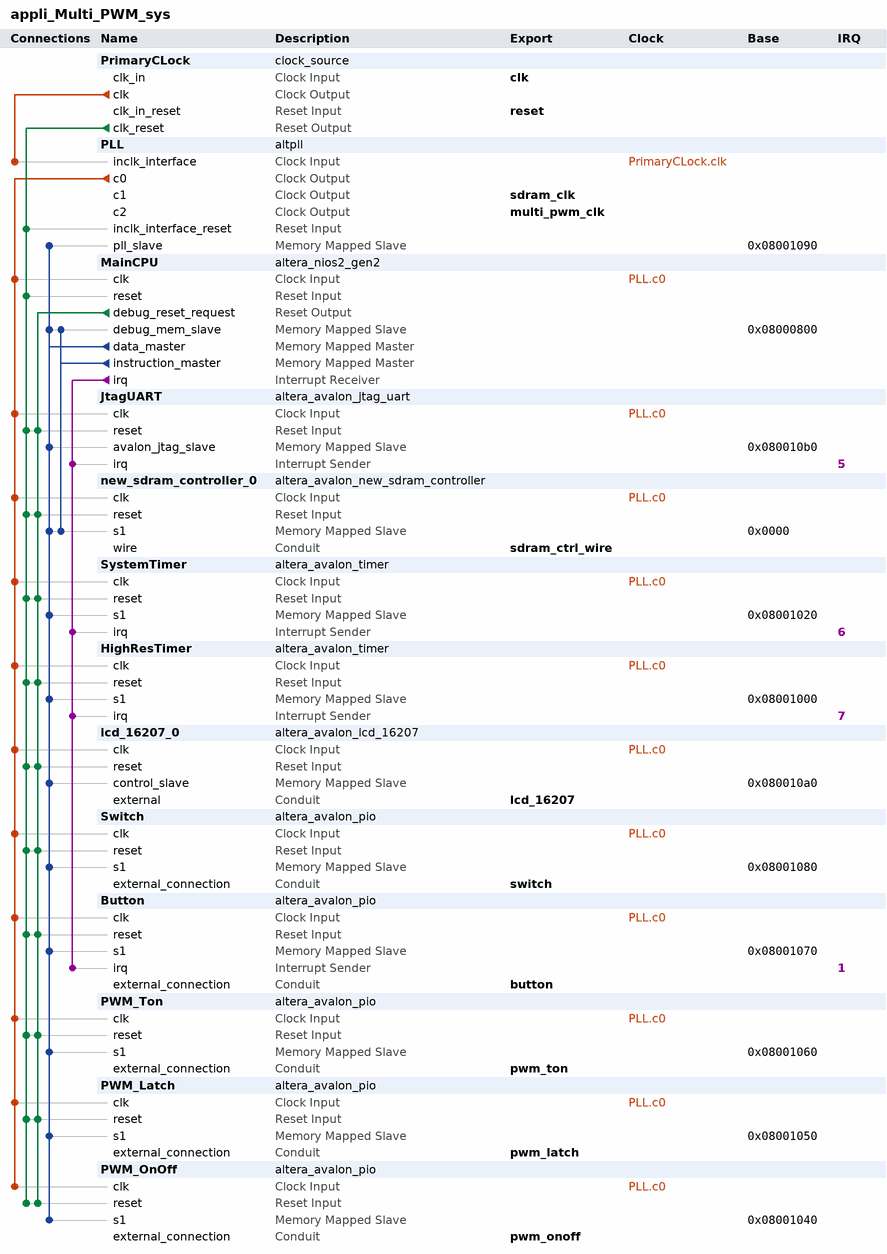
[diagram p0: system contents]
# Platform Designer (Qsys) system appli_Multi_PWM_sys, Cyclone IV E EP4CE115F29C7
# Parameters at their usual value, and those the tool derives, are not listed.
package require -exact qsys 17.1
create_system appli_Multi_PWM_sys
set_project_property DEVICE_FAMILY {Cyclone IV E}
set_project_property DEVICE EP4CE115F29C7

add_instance PrimaryCLock clock_source 17.1
set_instance_parameter_value PrimaryCLock clockFrequency 50000000

add_instance PLL altpll 17.1
set_instance_parameter_value PLL CLK0_DIVIDE_BY 1
set_instance_parameter_value PLL CLK0_MULTIPLY_BY 2
set_instance_parameter_value PLL CLK1_DIVIDE_BY 1
set_instance_parameter_value PLL CLK1_DUTY_CYCLE 50
set_instance_parameter_value PLL CLK1_MULTIPLY_BY 2
set_instance_parameter_value PLL CLK1_PHASE_SHIFT -1667
set_instance_parameter_value PLL CLK2_DIVIDE_BY 3125
set_instance_parameter_value PLL CLK2_DUTY_CYCLE 50
set_instance_parameter_value PLL CLK2_MULTIPLY_BY 64
set_instance_parameter_value PLL CLK2_PHASE_SHIFT 0
set_instance_parameter_value PLL INCLK0_INPUT_FREQUENCY 20000
set_instance_parameter_value PLL PORT_ARESET PORT_UNUSED
set_instance_parameter_value PLL PORT_LOCKED PORT_UNUSED
set_instance_parameter_value PLL PORT_clk1 PORT_USED
set_instance_parameter_value PLL PORT_clk2 PORT_USED
set_instance_parameter_value PLL PORT_clk3 PORT_UNUSED

add_instance MainCPU altera_nios2_gen2 17.1
set_instance_parameter_value MainCPU dcache_size 2048
set_instance_parameter_value MainCPU exceptionSlave new_sdram_controller_0.s1
set_instance_parameter_value MainCPU icache_size 4096
set_instance_parameter_value MainCPU impl Tiny
set_instance_parameter_value MainCPU resetSlave new_sdram_controller_0.s1

add_instance JtagUART altera_avalon_jtag_uart 17.1
set_instance_parameter_value JtagUART simInteractiveOptions NO_INTERACTIVE_WINDOWS

add_instance new_sdram_controller_0 altera_avalon_new_sdram_controller 17.1
set_instance_parameter_value new_sdram_controller_0 TAC 5.5
set_instance_parameter_value new_sdram_controller_0 TRCD 20.0
set_instance_parameter_value new_sdram_controller_0 TRP 20.0
set_instance_parameter_value new_sdram_controller_0 casLatency 3
set_instance_parameter_value new_sdram_controller_0 columnWidth 10
set_instance_parameter_value new_sdram_controller_0 dataWidth 32
set_instance_parameter_value new_sdram_controller_0 generateSimulationModel false
set_instance_parameter_value new_sdram_controller_0 model single_Micron_MT48LC4M32B2_7_chip
set_instance_parameter_value new_sdram_controller_0 numberOfBanks 4
set_instance_parameter_value new_sdram_controller_0 numberOfChipSelects 1
set_instance_parameter_value new_sdram_controller_0 powerUpDelay 200.0
set_instance_parameter_value new_sdram_controller_0 refreshPeriod 7.8125
set_instance_parameter_value new_sdram_controller_0 rowWidth 13

add_instance SystemTimer altera_avalon_timer 17.1
set_instance_parameter_value SystemTimer period 1
set_instance_parameter_value SystemTimer periodUnits MSEC

add_instance HighResTimer altera_avalon_timer 17.1
set_instance_parameter_value HighResTimer period 1
set_instance_parameter_value HighResTimer periodUnits USEC

add_instance lcd_16207_0 altera_avalon_lcd_16207 17.1

add_instance Switch altera_avalon_pio 17.1
set_instance_parameter_value Switch direction Input
set_instance_parameter_value Switch width 4

add_instance Button altera_avalon_pio 17.1
set_instance_parameter_value Button captureEdge true
set_instance_parameter_value Button direction Input
set_instance_parameter_value Button edgeType FALLING
set_instance_parameter_value Button generateIRQ true
set_instance_parameter_value Button irqType EDGE
set_instance_parameter_value Button width 3

add_instance PWM_Ton altera_avalon_pio 17.1
set_instance_parameter_value PWM_Ton direction Output
set_instance_parameter_value PWM_Ton width 10

add_instance PWM_Latch altera_avalon_pio 17.1
set_instance_parameter_value PWM_Latch direction Output
set_instance_parameter_value PWM_Latch width 24

add_instance PWM_OnOff altera_avalon_pio 17.1
set_instance_parameter_value PWM_OnOff direction Output
set_instance_parameter_value PWM_OnOff width 24

# connections
add_connection PLL.c0 Button.clk clock
add_connection PLL.c0 HighResTimer.clk clock
add_connection PLL.c0 JtagUART.clk clock
add_connection PLL.c0 lcd_16207_0.clk clock
add_connection PLL.c0 MainCPU.clk clock
add_connection PLL.c0 new_sdram_controller_0.clk clock
add_connection PLL.c0 PWM_Latch.clk clock
add_connection PLL.c0 PWM_OnOff.clk clock
add_connection PLL.c0 PWM_Ton.clk clock
add_connection PLL.c0 Switch.clk clock
add_connection PLL.c0 SystemTimer.clk clock
add_connection PrimaryCLock.clk PLL.inclk_interface clock
add_connection MainCPU.debug_reset_request Button.reset reset
add_connection MainCPU.debug_reset_request HighResTimer.reset reset
add_connection MainCPU.debug_reset_request JtagUART.reset reset
add_connection MainCPU.debug_reset_request lcd_16207_0.reset reset
add_connection MainCPU.debug_reset_request new_sdram_controller_0.reset reset
add_connection MainCPU.debug_reset_request PWM_Latch.reset reset
add_connection MainCPU.debug_reset_request PWM_OnOff.reset reset
add_connection MainCPU.debug_reset_request PWM_Ton.reset reset
add_connection MainCPU.debug_reset_request Switch.reset reset
add_connection MainCPU.debug_reset_request SystemTimer.reset reset
add_connection PrimaryCLock.clk_reset Button.reset reset
add_connection PrimaryCLock.clk_reset HighResTimer.reset reset
add_connection PrimaryCLock.clk_reset JtagUART.reset reset
add_connection PrimaryCLock.clk_reset lcd_16207_0.reset reset
add_connection PrimaryCLock.clk_reset MainCPU.reset reset
add_connection PrimaryCLock.clk_reset new_sdram_controller_0.reset reset
add_connection PrimaryCLock.clk_reset PLL.inclk_interface_reset reset
add_connection PrimaryCLock.clk_reset PWM_Latch.reset reset
add_connection PrimaryCLock.clk_reset PWM_OnOff.reset reset
add_connection PrimaryCLock.clk_reset PWM_Ton.reset reset
add_connection PrimaryCLock.clk_reset Switch.reset reset
add_connection PrimaryCLock.clk_reset SystemTimer.reset reset
add_connection MainCPU.data_master Button.s1 avalon
set_connection_parameter_value MainCPU.data_master/Button.s1 baseAddress 0x08001070
add_connection MainCPU.data_master HighResTimer.s1 avalon
set_connection_parameter_value MainCPU.data_master/HighResTimer.s1 baseAddress 0x08001000
add_connection MainCPU.data_master JtagUART.avalon_jtag_slave avalon
set_connection_parameter_value MainCPU.data_master/JtagUART.avalon_jtag_slave baseAddress 0x080010b0
add_connection MainCPU.data_master lcd_16207_0.control_slave avalon
set_connection_parameter_value MainCPU.data_master/lcd_16207_0.control_slave baseAddress 0x080010a0
add_connection MainCPU.data_master MainCPU.debug_mem_slave avalon
set_connection_parameter_value MainCPU.data_master/MainCPU.debug_mem_slave baseAddress 0x08000800
add_connection MainCPU.data_master new_sdram_controller_0.s1 avalon
set_connection_parameter_value MainCPU.data_master/new_sdram_controller_0.s1 baseAddress 0x0000
add_connection MainCPU.data_master PLL.pll_slave avalon
set_connection_parameter_value MainCPU.data_master/PLL.pll_slave baseAddress 0x08001090
add_connection MainCPU.data_master PWM_Latch.s1 avalon
set_connection_parameter_value MainCPU.data_master/PWM_Latch.s1 baseAddress 0x08001050
add_connection MainCPU.data_master PWM_OnOff.s1 avalon
set_connection_parameter_value MainCPU.data_master/PWM_OnOff.s1 baseAddress 0x08001040
add_connection MainCPU.data_master PWM_Ton.s1 avalon
set_connection_parameter_value MainCPU.data_master/PWM_Ton.s1 baseAddress 0x08001060
add_connection MainCPU.data_master Switch.s1 avalon
set_connection_parameter_value MainCPU.data_master/Switch.s1 baseAddress 0x08001080
add_connection MainCPU.data_master SystemTimer.s1 avalon
set_connection_parameter_value MainCPU.data_master/SystemTimer.s1 baseAddress 0x08001020
add_connection MainCPU.instruction_master MainCPU.debug_mem_slave avalon
set_connection_parameter_value MainCPU.instruction_master/MainCPU.debug_mem_slave baseAddress 0x08000800
add_connection MainCPU.instruction_master new_sdram_controller_0.s1 avalon
set_connection_parameter_value MainCPU.instruction_master/new_sdram_controller_0.s1 baseAddress 0x0000
add_connection MainCPU.irq Button.irq interrupt
set_connection_parameter_value MainCPU.irq/Button.irq irqNumber 1
add_connection MainCPU.irq HighResTimer.irq interrupt
set_connection_parameter_value MainCPU.irq/HighResTimer.irq irqNumber 7
add_connection MainCPU.irq JtagUART.irq interrupt
set_connection_parameter_value MainCPU.irq/JtagUART.irq irqNumber 5
add_connection MainCPU.irq SystemTimer.irq interrupt
set_connection_parameter_value MainCPU.irq/SystemTimer.irq irqNumber 6

# exported interfaces
add_interface button conduit end
set_interface_property button EXPORT_OF Button.external_connection
add_interface clk clock sink
set_interface_property clk EXPORT_OF PrimaryCLock.clk_in
add_interface lcd_16207 conduit end
set_interface_property lcd_16207 EXPORT_OF lcd_16207_0.external
add_interface multi_pwm_clk clock source
set_interface_property multi_pwm_clk EXPORT_OF PLL.c2
add_interface pwm_latch conduit end
set_interface_property pwm_latch EXPORT_OF PWM_Latch.external_connection
add_interface pwm_onoff conduit end
set_interface_property pwm_onoff EXPORT_OF PWM_OnOff.external_connection
add_interface pwm_ton conduit end
set_interface_property pwm_ton EXPORT_OF PWM_Ton.external_connection
add_interface reset reset sink
set_interface_property reset EXPORT_OF PrimaryCLock.clk_in_reset
add_interface sdram_clk clock source
set_interface_property sdram_clk EXPORT_OF PLL.c1
add_interface sdram_ctrl_wire conduit end
set_interface_property sdram_ctrl_wire EXPORT_OF new_sdram_controller_0.wire
add_interface switch conduit end
set_interface_property switch EXPORT_OF Switch.external_connection

set_interconnect_requirement {$system} qsys_mm.clockCrossingAdapter HANDSHAKE
set_interconnect_requirement {$system} qsys_mm.enableEccProtection FALSE
set_interconnect_requirement {$system} qsys_mm.insertDefaultSlave FALSE
set_interconnect_requirement {$system} qsys_mm.maxAdditionalLatency 1

save_system appli_Multi_PWM_sys.qsys
